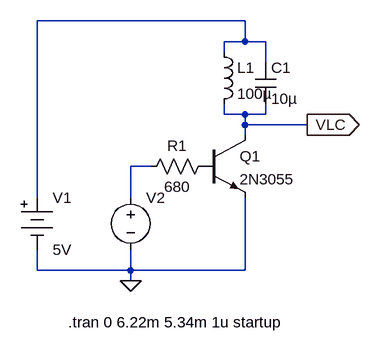
[diagram p0: schematic ImplemendedCurrentSource1.asc]
ImplemendedCurrentSource1.asc, the LTspice schematic file:
Version 4
SHEET 1 880 680
WIRE 544 96 224 96
WIRE 544 128 544 96
WIRE 544 128 512 128
WIRE 576 128 544 128
WIRE 512 144 512 128
WIRE 576 160 576 128
WIRE 512 240 512 224
WIRE 544 240 512 240
WIRE 576 240 576 224
WIRE 576 240 544 240
WIRE 544 256 544 240
WIRE 640 256 544 256
WIRE 544 272 544 256
WIRE 400 320 368 320
WIRE 224 368 224 96
WIRE 368 368 368 320
WIRE 224 480 224 448
WIRE 368 480 368 448
WIRE 368 480 224 480
WIRE 544 480 544 368
WIRE 544 480 368 480
WIRE 368 496 368 480
FLAG 368 496 0
FLAG 640 256 VLC
IOPIN 640 256 Out
SYMBOL Misc/battery 224 352 R0
SYMATTR InstName V1
SYMATTR Value 5V
SYMATTR SpiceLine Rser=3
SYMBOL voltage 368 352 R0
WINDOW 3 24 96 Invisible 2
WINDOW 123 0 0 Left 0
SYMATTR InstName V2
SYMATTR Value PULSE(0 1v 0 1us 1us .888ms 1.78ms)
SYMATTR SpiceLine Rser=0
SYMBOL ind 496 128 R0
SYMATTR InstName L1
SYMATTR Value 100µ
SYMBOL cap 560 160 R0
SYMATTR InstName C1
SYMATTR Value 10µ
SYMBOL res 496 304 R90
WINDOW 0 0 56 VBottom 2
WINDOW 3 32 56 VTop 2
SYMATTR InstName R1
SYMATTR Value 680
SYMBOL npn 480 272 R0
SYMATTR InstName Q1
SYMATTR Value 2N3055
TEXT 272 560 Left 2 !.tran 0 6.22m 5.34m 1u startup

The netlist it stands for:
* ImplemendedCurrentSource1.asc
V1 N001 0 5V Rser=3
V2 N002 0 PULSE(0 1v 0 1us 1us .888ms 1.78ms) Rser=0
L1 N001 VLC 100µ
C1 N001 VLC 10µ
R1 P001 N002 680
Q1 VLC P001 0 0 2N3055
.model NPN NPN
.model PNP PNP
.lib standard.bjt
.tran 0 6.22m 5.34m 1u startup
.backanno
.end